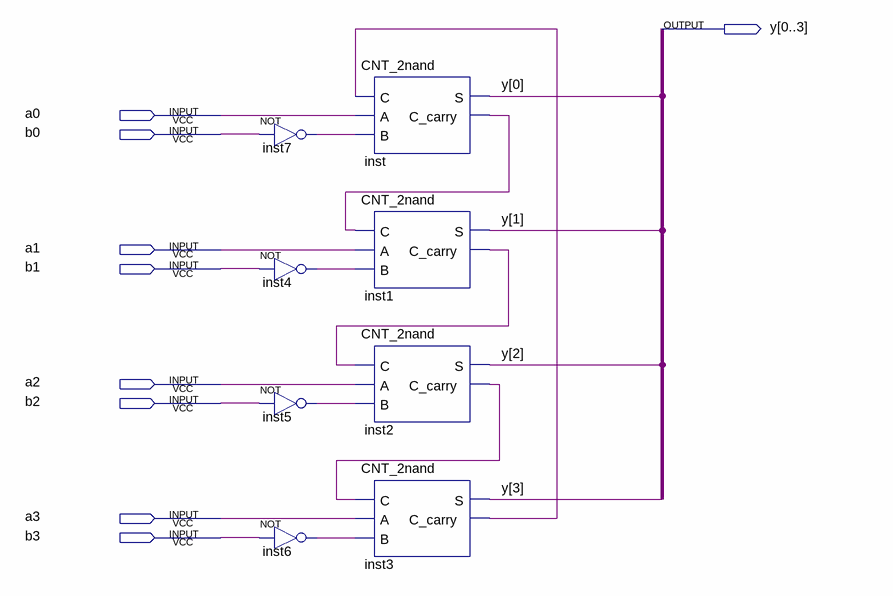
[diagram p0: schematic sheet]
// Quartus schematic Subtractor.bdf as structural Verilog: 8 symbols, 9 pins
module Subtractor (
  input  a0,
  input  b0,
  input  a1,
  input  b1,
  input  a2,
  input  b2,
  input  a3,
  input  b3,
  output [0:3] y
);

  wire inst1_c_carry, inst2_c_carry, inst3_c_carry, inst4_out, inst5_out, inst6_out, inst7_out, inst_c_carry;

  not inst7 (inst7_out, b0);
  not inst4 (inst4_out, b1);
  not inst5 (inst5_out, b2);
  not inst6 (inst6_out, b3);
  CNT_2nand inst (.C(inst3_c_carry), .A(a0), .B(inst7_out), .S(y[0]), .C_carry(inst_c_carry));
  CNT_2nand inst1 (.C(inst_c_carry), .A(a1), .B(inst4_out), .S(y[1]), .C_carry(inst1_c_carry));
  CNT_2nand inst2 (.C(inst1_c_carry), .A(a2), .B(inst5_out), .S(y[2]), .C_carry(inst2_c_carry));
  CNT_2nand inst3 (.C(inst2_c_carry), .A(a3), .B(inst6_out), .S(y[3]), .C_carry(inst3_c_carry));
endmodule
